# EasyEDA schematic SCH_d_00_e_00.json
TITLE: D_00_E_00; REV: 1.0; Date: 2025-01-09; Sheet: 1/1; Company: provemet
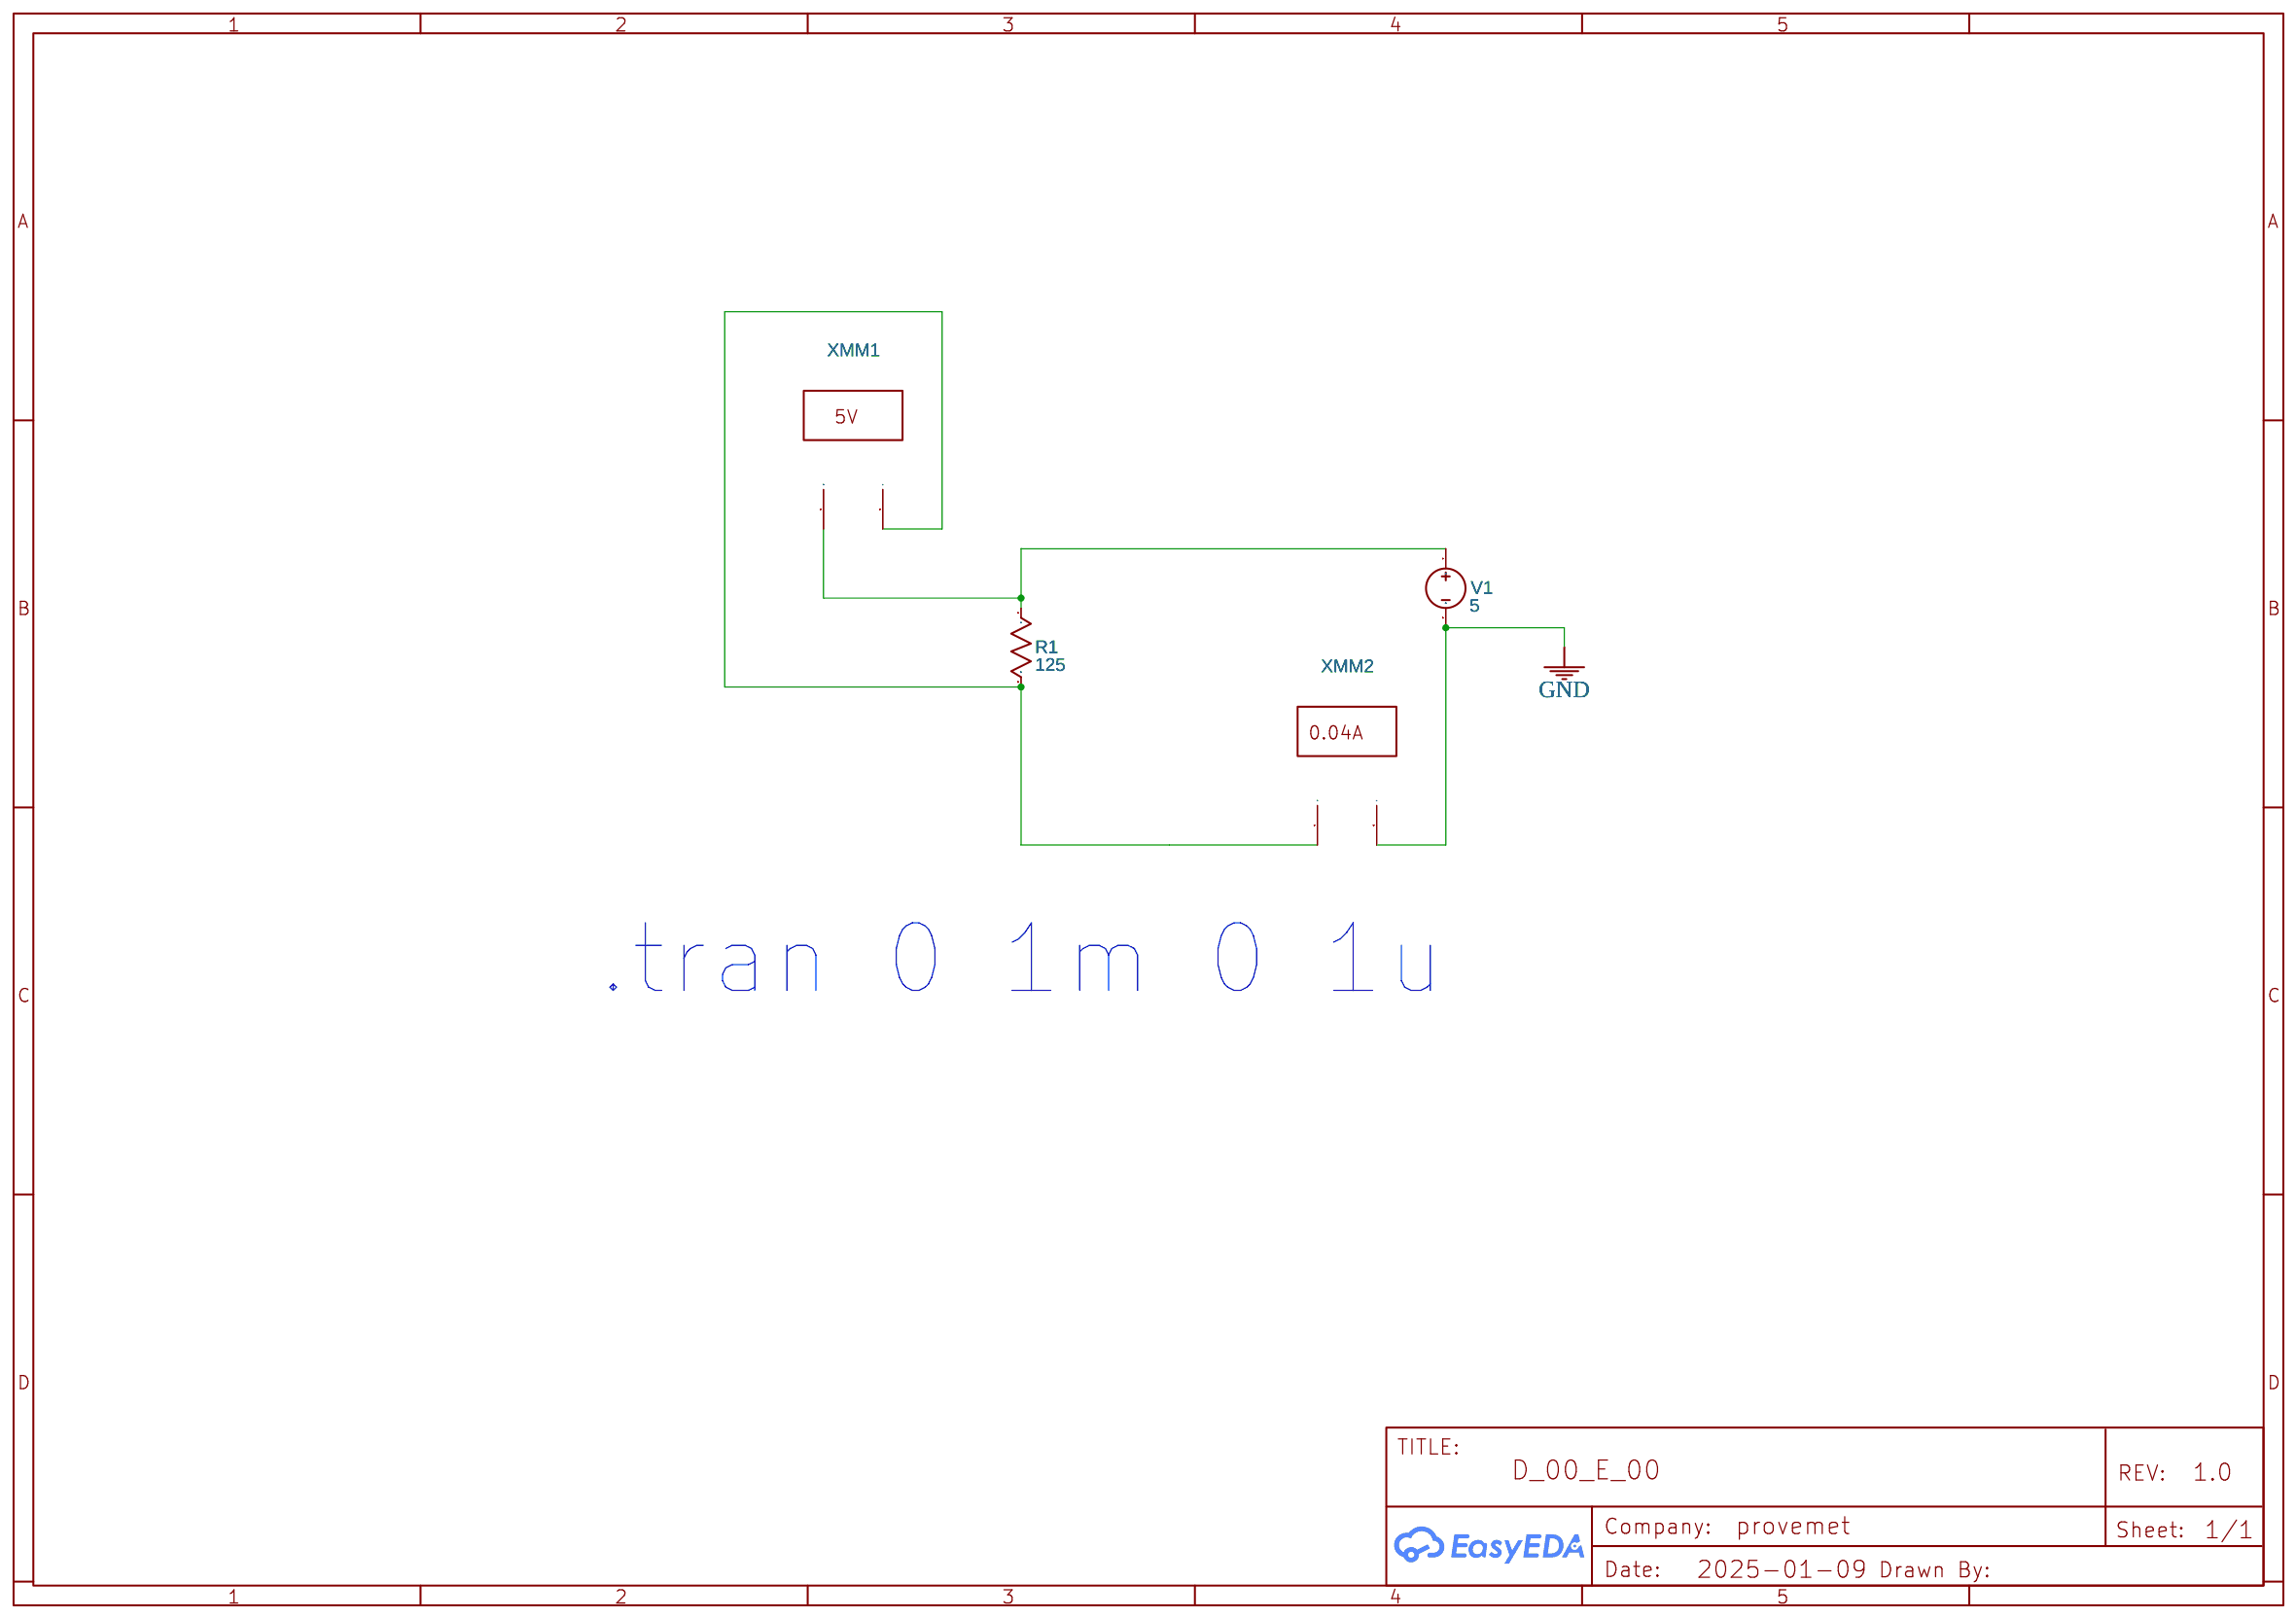
[diagram p0: schematic sheet]

## Parts
R1  125  [AXIAL-0.3]
V1  5  [HDR1X2]
XMM1  Multimeter
XMM2  Multimeter

## Library data of the parts
R1 = Resistor_US: Resistance: 1k; Contributor: EasyEDA; Supplier: YUJING
V1 = VDC: Contributor: EasyEDA; sim: true
XMM1 = MULTIMETER: Supplier: LCSC; Multimeter Type: Voltmeter; Power Type: AC; Voltmeter resistance: 10μ; Ammeter resistance: 1G; NameDisplay: 0; Contributor: EasyEDA; sim: true
XMM2 = MULTIMETER: Supplier: LCSC; Multimeter Type: Amper; Power Type: AC; Voltmeter resistance: 10μ; Ammeter resistance: 1G; NameDisplay: 0; Contributor: EasyEDA; sim: true

## Nets
GND: V1.2 XMM2.2(I)
Net-(R1-1): R1.1 V1.1 XMM1.1(+)
Net-(R1-2): R1.2 XMM1.2(I) XMM2.1(+)

## Notes on the sheet
- .tran 0 1m 0 1u
